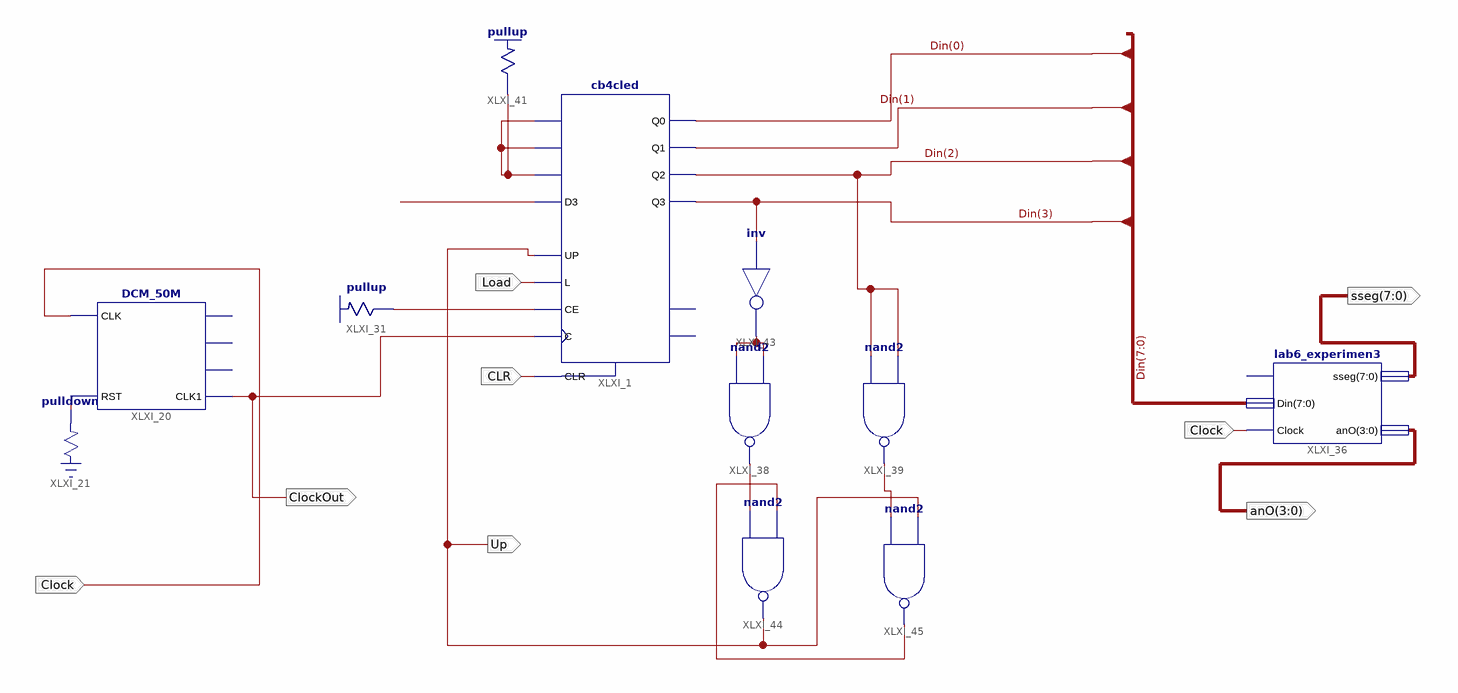
[diagram p0: schematic sheet 1]
// Xilinx ISE schematic lab8_exp7.sch (spartan3e) as structural Verilog: 11 symbols, 7 ports
module lab8_exp7 (
  input  Clock,
  input  CLR,
  input  Load,
  output ClockOut,
  output [7:0] sseg,
  output [3:0] anO,
  output Up
);

  wire XLXN_28, XLXN_30, XLXN_37, XLXN_44, XLXN_45, XLXN_58, XLXN_59, XLXN_60;
  wire [7:0] Din;

  cb4cled XLXI_1 (
    .C(ClockOut), .CE(XLXN_30), .CLR(CLR), .D0(XLXN_44), .D1(XLXN_44), .D2(XLXN_44), .D3(XLXN_45), .L(Load),
    .UP(Up), .Q0(Din[0]), .Q1(Din[1]), .Q2(Din[2]), .Q3(Din[3]));  // open: CEO, TC
  DCM_50M XLXI_20 (.CLK(Clock), .RST(XLXN_28), .CLK1(ClockOut));  // open: CLK1M, CLK10k, CLK1k
  \pulldown  XLXI_21 (.O(XLXN_28));
  \pullup  XLXI_31 (.O(XLXN_30));
  lab6_experimen3 XLXI_36 (.Din(Din), .Clock(Clock), .sseg(sseg), .anO(anO));  // open: En
  nand XLXI_38 (XLXN_58, XLXN_37, XLXN_37);
  nand XLXI_39 (XLXN_60, Din[2], Din[2]);
  \pullup  XLXI_41 (.O(XLXN_44));
  not XLXI_43 (XLXN_37, Din[3]);
  nand XLXI_44 (Up, XLXN_58, XLXN_59);
  nand XLXI_45 (XLXN_59, XLXN_60, Up);
endmodule
